# Altium schematic sheet connectors.SchDoc
size 209 x 297 mm; Address1: Address1; Address2: Address2; Address3: Address3; Address4: Address4; SheetNumber: 1; SheetTotal: 1; Scale: 1:1; Разраб.: Михаил Каа; Обозначение документа: МГТФ.001 Э3; Пров.: no check; Утв.: chat; Номер листа: 1; Общее количество листов: 1; Наименование организации: Михаил Каа; Перв. применение: МГТФ.001; Наименование изделия 1: МГТФ; Наименование изделия 2: Схема электрическая; Наименование изделия 3: принципиальная; Нач. отд.: Нач. отд.; Фамилия нач. отд.: chat
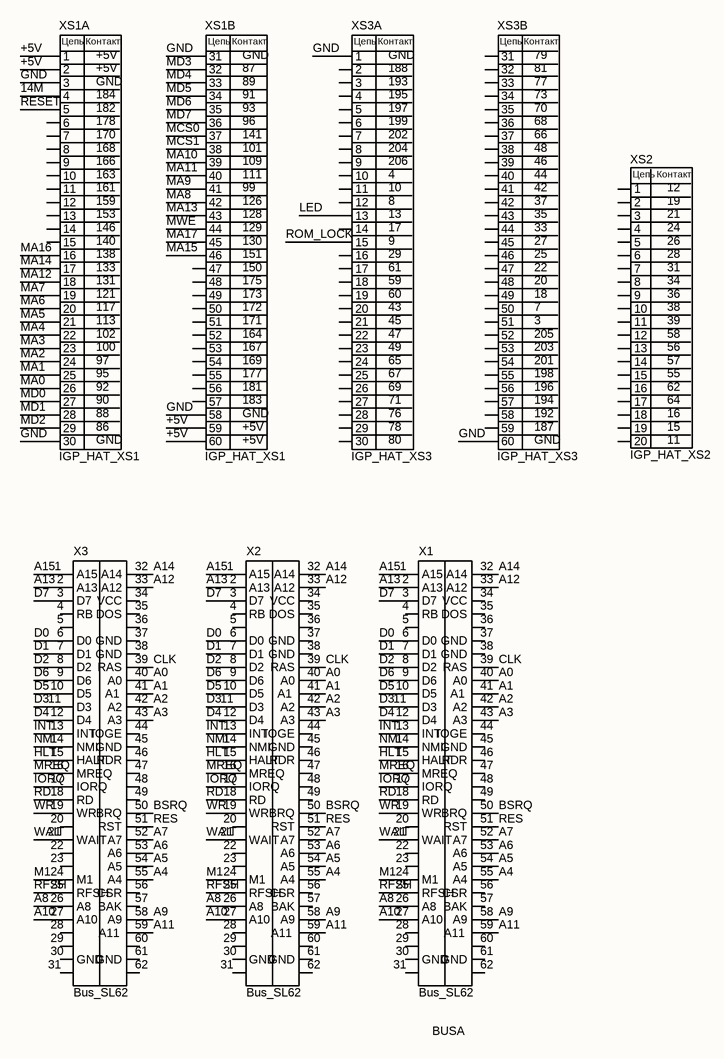
[diagram p0: connectors.SchDoc]

## Parts
X1  Bus_SL62  [SL62]
X2  Bus_SL62  [SL62]
X3  Bus_SL62  [SL62]
XS1  IGP_HAT_XS1  [IGP_HAT_XS_60PIN]  (parts A,B of 2)
XS2  IGP_HAT_XS2  [IGP_HAT_XS_20PIN]
XS3  IGP_HAT_XS3  [IGP_HAT_XS_60PIN]  (parts A,B of 2)

## Nets
14M: XS1.4
+5V: XS1.1 XS1.2 XS1.59 XS1.60
A0: X1.40(A0) X2.40(A0) X3.40(A0)
A1: X1.41(A1) X2.41(A1) X3.41(A1)
A2: X1.42(A2) X2.42(A2) X3.42(A2)
A3: X1.43(A3) X2.43(A3) X3.43(A3)
A4: X1.55(A4) X2.55(A4) X3.55(A4)
A5: X1.54(A5) X2.54(A5) X3.54(A5)
A6: X1.53(A6) X2.53(A6) X3.53(A6)
A7: X1.52(A7) X2.52(A7) X3.52(A7)
A8: X1.26(A8) X2.26(A8) X3.26(A8)
A9: X1.58(A9) X2.58(A9) X3.58(A9)
A10: X1.27(A10) X2.27(A10) X3.27(A10)
A11: X1.59(A11) X2.59(A11) X3.59(A11)
A12: X1.33(A12) X2.33(A12) X3.33(A12)
A13: X1.2(A13) X2.2(A13) X3.2(A13)
A14: X1.32(A14) X2.32(A14) X3.32(A14)
A15: X1.1(A15) X2.1(A15) X3.1(A15)
BSRQ: X1.50(BRQ) X2.50(BRQ) X3.50(BRQ)
CLK: X1.39(RAS) X2.39(RAS) X3.39(RAS)
D0: X1.6(D0) X2.6(D0) X3.6(D0)
D1: X1.7(D1) X2.7(D1) X3.7(D1)
D2: X1.8(D2) X2.8(D2) X3.8(D2)
D3: X1.11(D3) X2.11(D3) X3.11(D3)
D4: X1.12(D4) X2.12(D4) X3.12(D4)
D5: X1.10(D5) X2.10(D5) X3.10(D5)
D6: X1.9(D6) X2.9(D6) X3.9(D6)
D7: X1.3(D7) X2.3(D7) X3.3(D7)
GND: XS1.3 XS1.30 XS1.31 XS1.58 XS3.1 XS3.60
HLT: X1.15(HALT) X2.15(HALT) X3.15(HALT)
INT: X1.13(INT) X2.13(INT) X3.13(INT)
IORQ: X1.17(IORQ) X2.17(IORQ) X3.17(IORQ)
LED: XS3.13
M1: X1.24(M1) X2.24(M1) X3.24(M1)
MA0: XS1.26
MA1: XS1.25
MA2: XS1.24
MA3: XS1.23
MA4: XS1.22
MA5: XS1.21
MA6: XS1.20
MA7: XS1.19
MA8: XS1.42
MA9: XS1.41
MA10: XS1.39
MA11: XS1.40
MA12: XS1.18
MA13: XS1.43
MA14: XS1.17
MA15: XS1.46
MA16: XS1.16
MA17: XS1.45
MCS0: XS1.37
MCS1: XS1.38
MD0: XS1.27
MD1: XS1.28
MD2: XS1.29
MD3: XS1.32
MD4: XS1.33
MD5: XS1.34
MD6: XS1.35
MD7: XS1.36
MREQ: X1.16(MREQ) X2.16(MREQ) X3.16(MREQ)
MWE: XS1.44
NMI: X1.14(NMI) X2.14(NMI) X3.14(NMI)
RD: X1.18(RD) X2.18(RD) X3.18(RD)
RES: X1.51(RST) X2.51(RST) X3.51(RST)
RESET: XS1.5
RFSH: X1.25(RFSH) X2.25(RFSH) X3.25(RFSH)
ROM_LOCK: XS3.15
WAIT: X1.21(WAIT) X2.21(WAIT) X3.21(WAIT)
WR: X1.19(WR) X2.19(WR) X3.19(WR)

Not connected (* = marked no-connect by the designer): X1 4(RB) 5 20 22 23 28 29 30(GND) 31 34(VCC) 35(DOS) 36 37(GND) 38(GND) 44(IOGE) 45(GND) 46(RDR) 47 48 49 56(CSR) 57(BAK) 60 61(GND) 62; X2 4(RB) 5 20 22 23 28 29 30(GND) 31 34(VCC) 35(DOS) 36 37(GND) 38(GND) 44(IOGE) 45(GND) 46(RDR) 47 48 49 56(CSR) 57(BAK) 60 61(GND) 62; X3 4(RB) 5 20 22 23 28 29 30(GND) 31 34(VCC) 35(DOS) 36 37(GND) 38(GND) 44(IOGE) 45(GND) 46(RDR) 47 48 49 56(CSR) 57(BAK) 60 61(GND) 62; XS1 6 7 8 9 10 11 12 13 14 15 47 48 49 50 51 52 53 54 55 56 57; XS2 1 2 3 4 5 6 7 8 9 10 11 12 13 14 15 16 17 18 19 20; XS3 2 3 4 5 6 7 8 9 10 11 12 14 16 17 18 19 20 21 22 23 24 25 26 27 28 29 30 31 32 33 34 35 36 37 38 39 40 41 42 43 44 45 46 47 48 49 50 51 52 53 54 55 56 57 58 59

## Notes on the sheet
- Labels drawn without touching a wire or pin: BUSA
- Подп. и дата
- Инв. № дубл.
- Взам. инв. №
- Инв. № подл.
- Изм.
- Лист
- № докум.
- Подп.
- Дата
- Копировал
- Формат А4
- (in symbol IGP_HAT_XS1, part A) Цепь; Контакт; +5V; GND; 184; 182; 178; 170; 168; 166; 163; 161; 159; 153; 146; 140; 138; 133; 131; 121; 117; 113; 102; 100; 97; 95; 92; 90; 88; 86
- (in symbol IGP_HAT_XS1, part B) Цепь; Контакт; GND; 87; 89; 91; 93; 96; 141; 101; 109; 111; 99; 126; 128; 129; 130; 151; 150; 175; 173; 172; 171; 164; 167; 169; 177; 181; 183; +5V
- (in symbol IGP_HAT_XS2) Цепь; Контакт; 21; 24; 26; 28; 31; 34; 36; 38; 39; 58; 56; 57; 55; 62; 64
- (in symbol IGP_HAT_XS3, part A) Цепь; Контакт; GND; 188; 193; 195; 197; 199; 202; 204; 206; 61; 65; 67; 69; 71; 76; 78; 80
- (in symbol IGP_HAT_XS3, part B) Цепь; Контакт; 79; 81; 77; 73; 70; 68; 66; 205; 203; 201; 198; 196; 194; 192; 187; GND